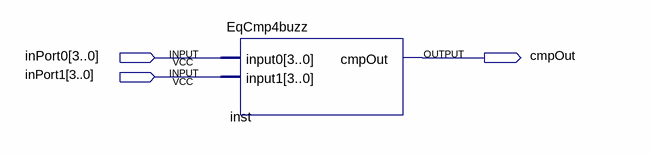
[diagram p0: schematic sheet]
// Quartus schematic EqCmpDemoBuzz.bdf as structural Verilog: 1 symbols, 3 pins
module EqCmpDemoBuzz (
  input  [3:0] inPort0,
  input  [3:0] inPort1,
  output cmpOut
);

  EqCmp4buzz inst (.input0(inPort0), .input1(inPort1), .cmpOut(cmpOut));
endmodule
